# Altium schematic sheet Sheet1.SchDoc
size 635 x 635 mm; SheetNumber: 1; SheetTotal: 1
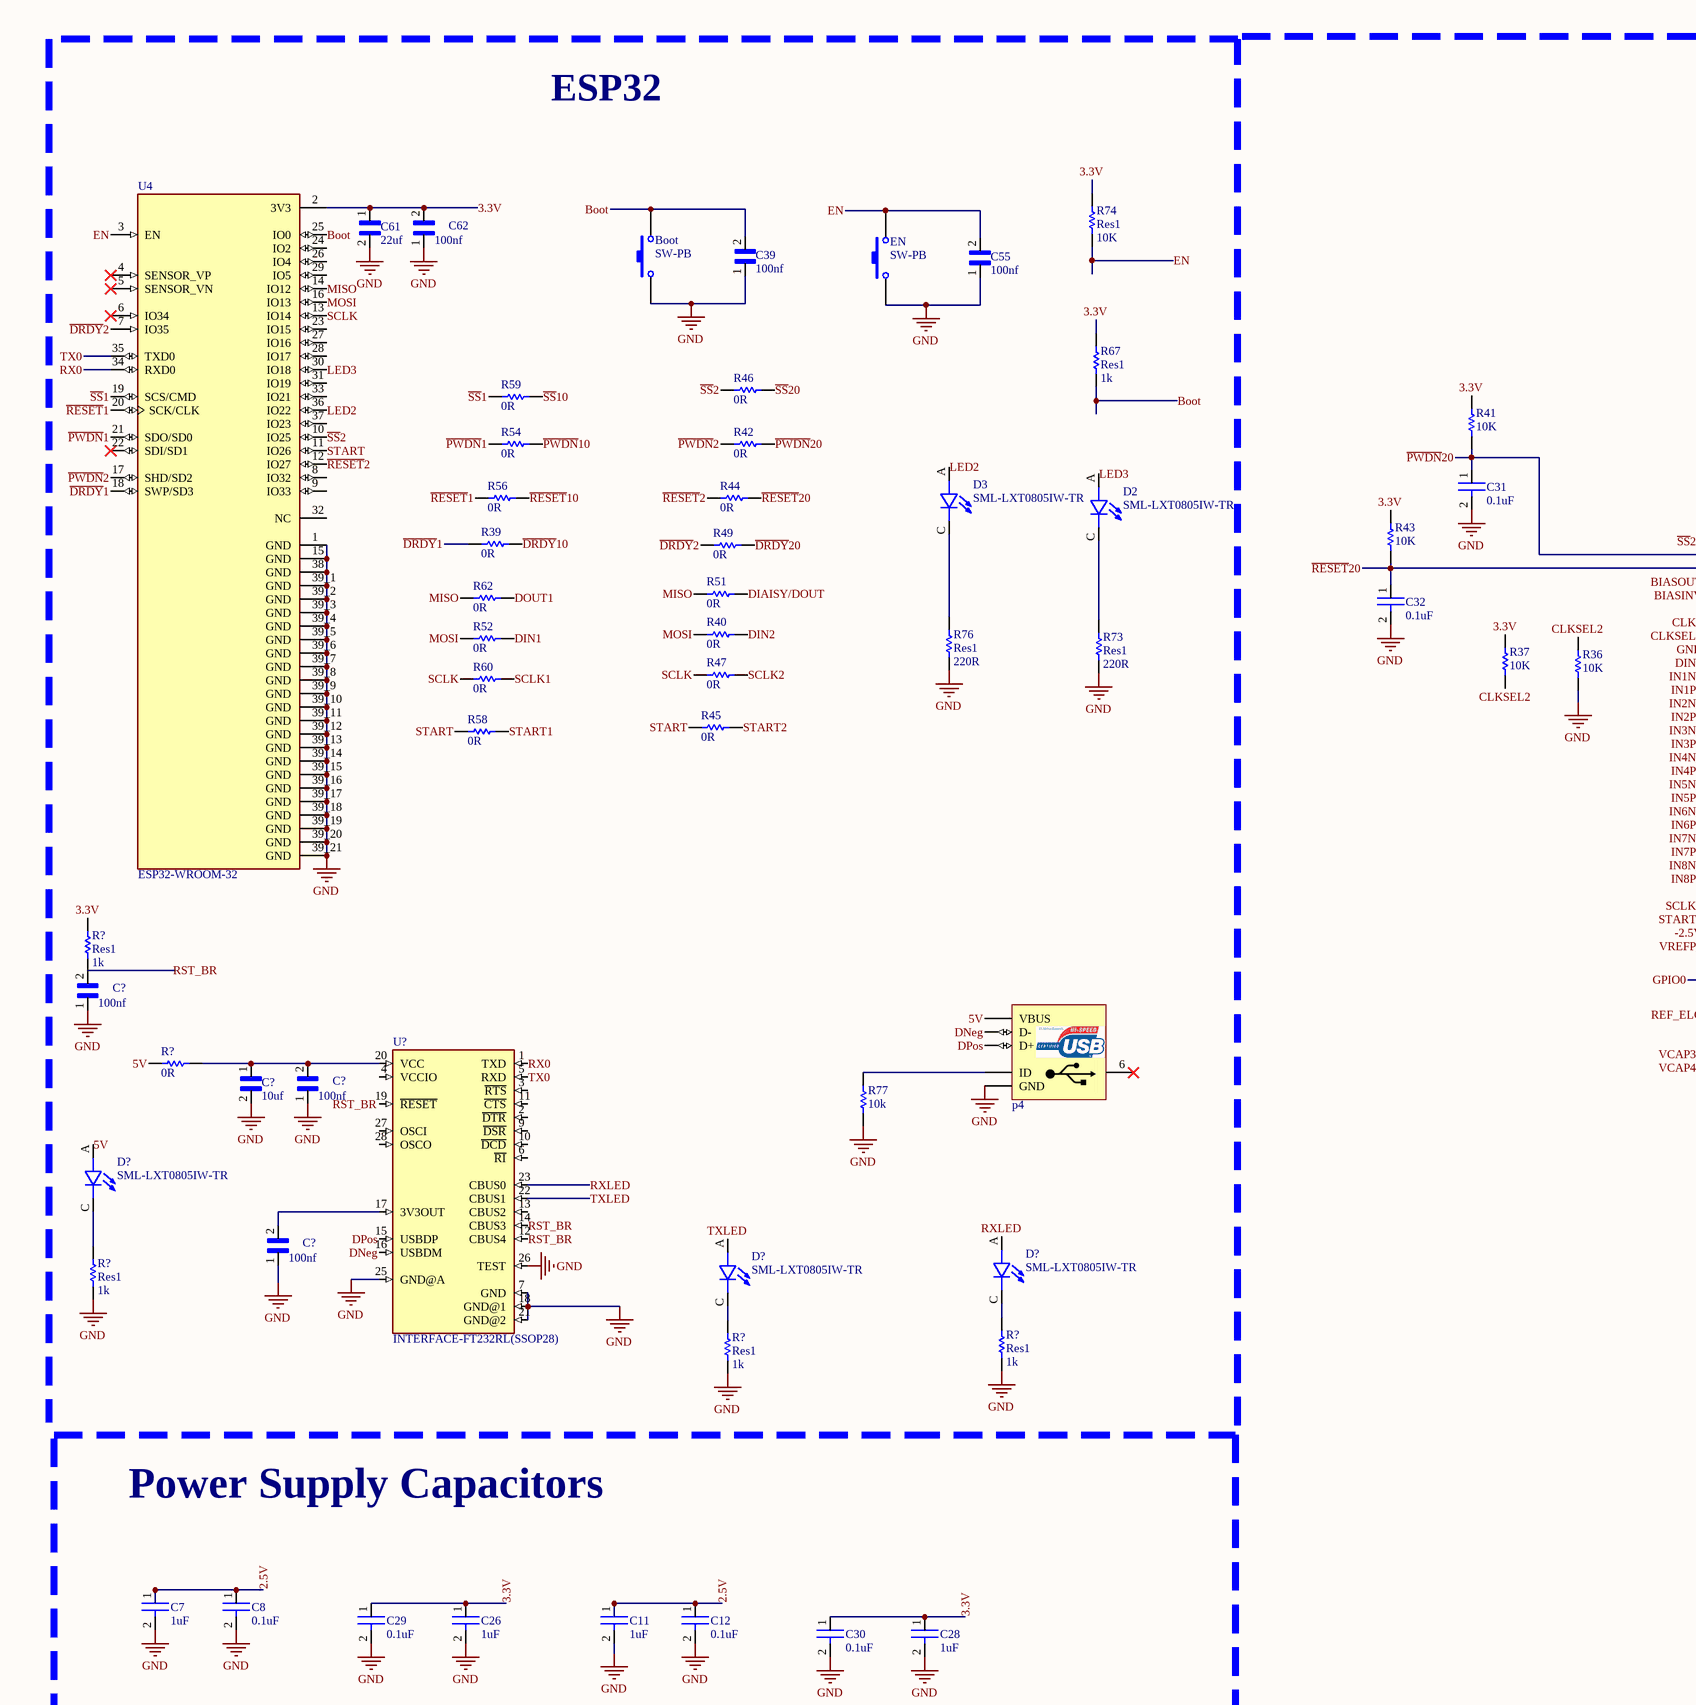
[diagram p0: Sheet1.SchDoc, top left]
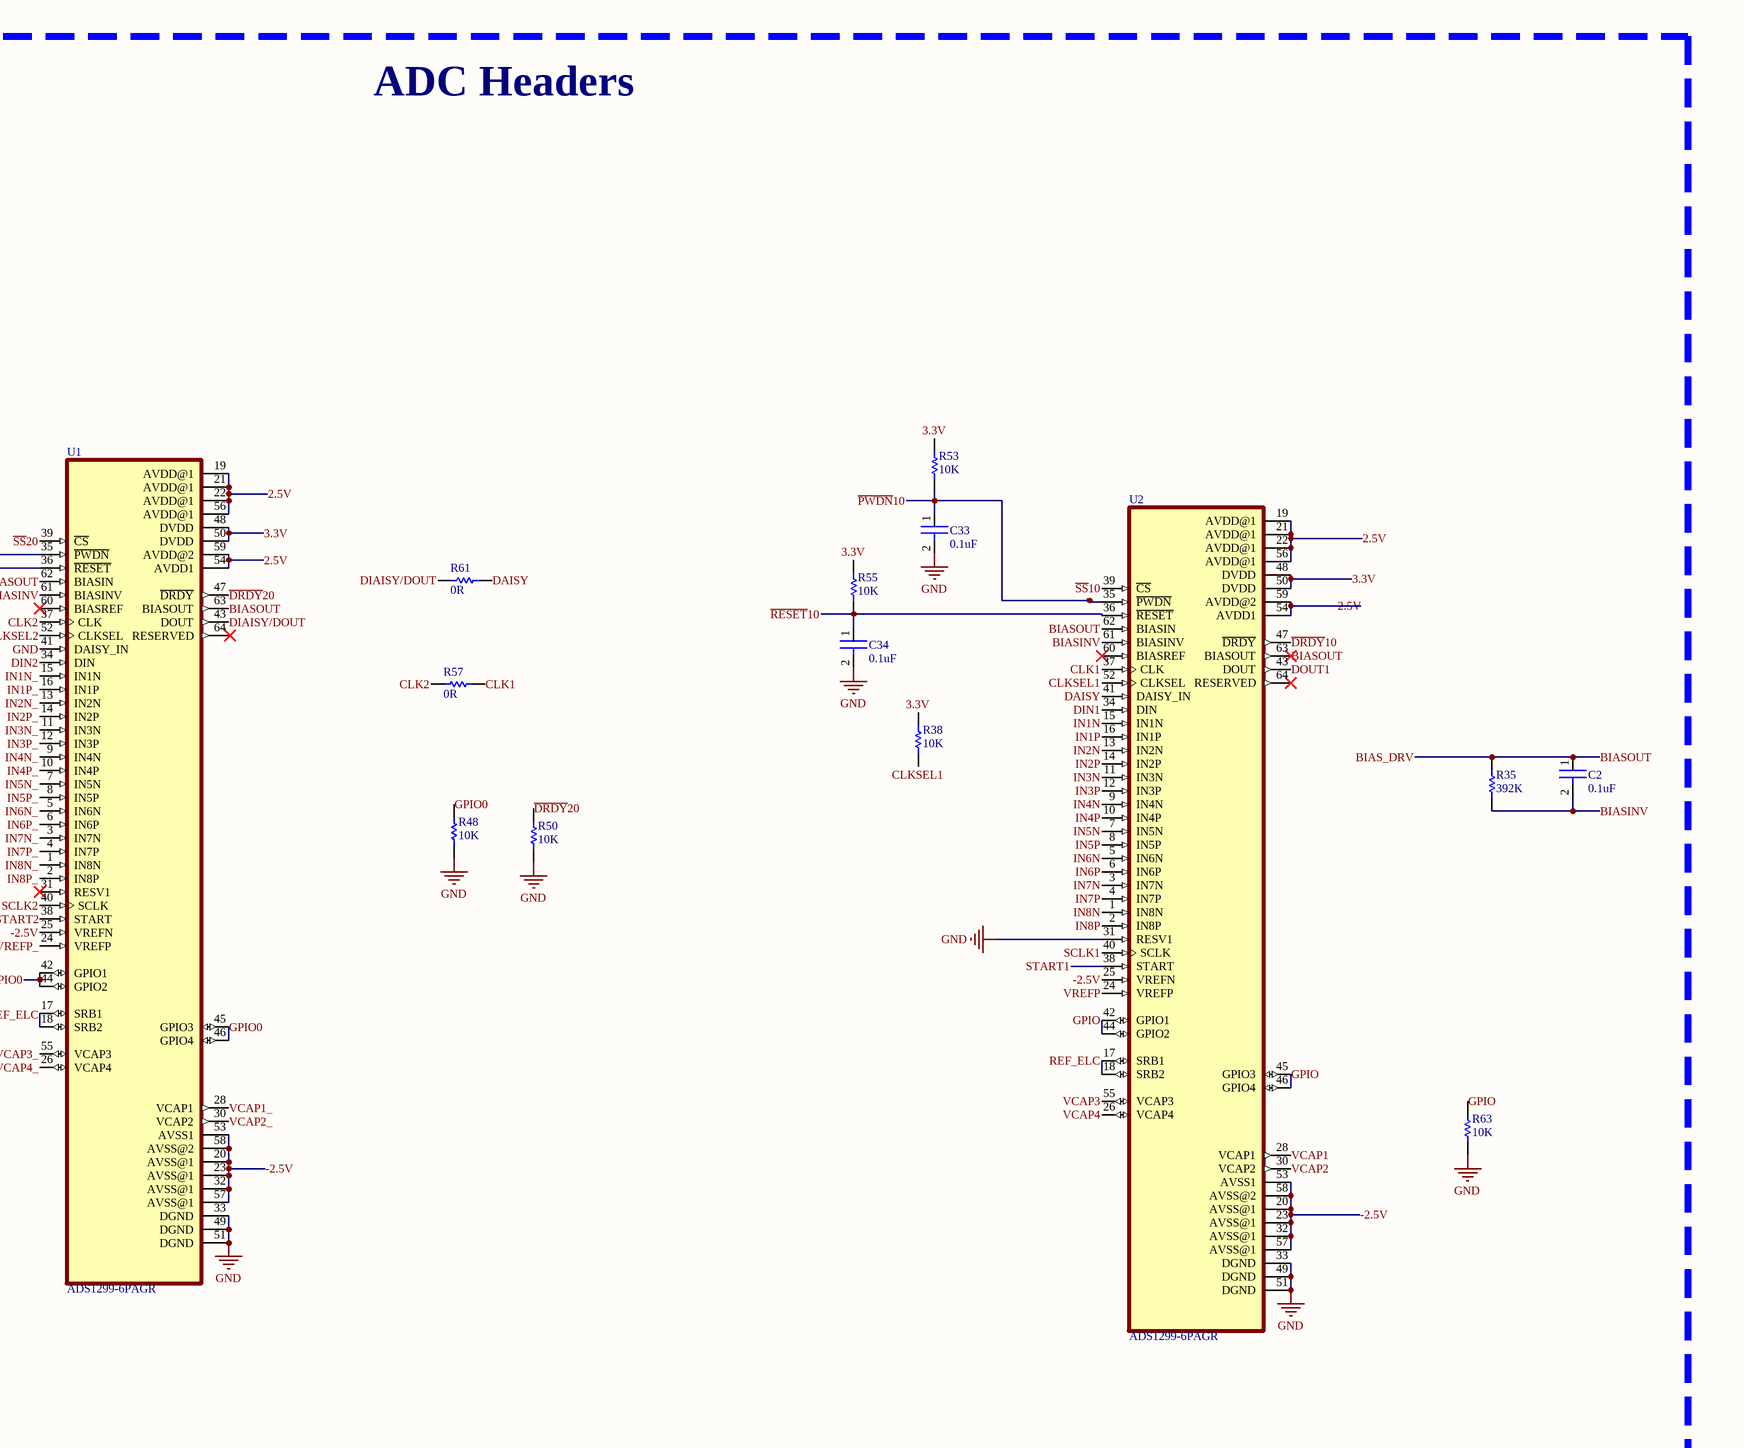
[diagram p1: Sheet1.SchDoc, top right]
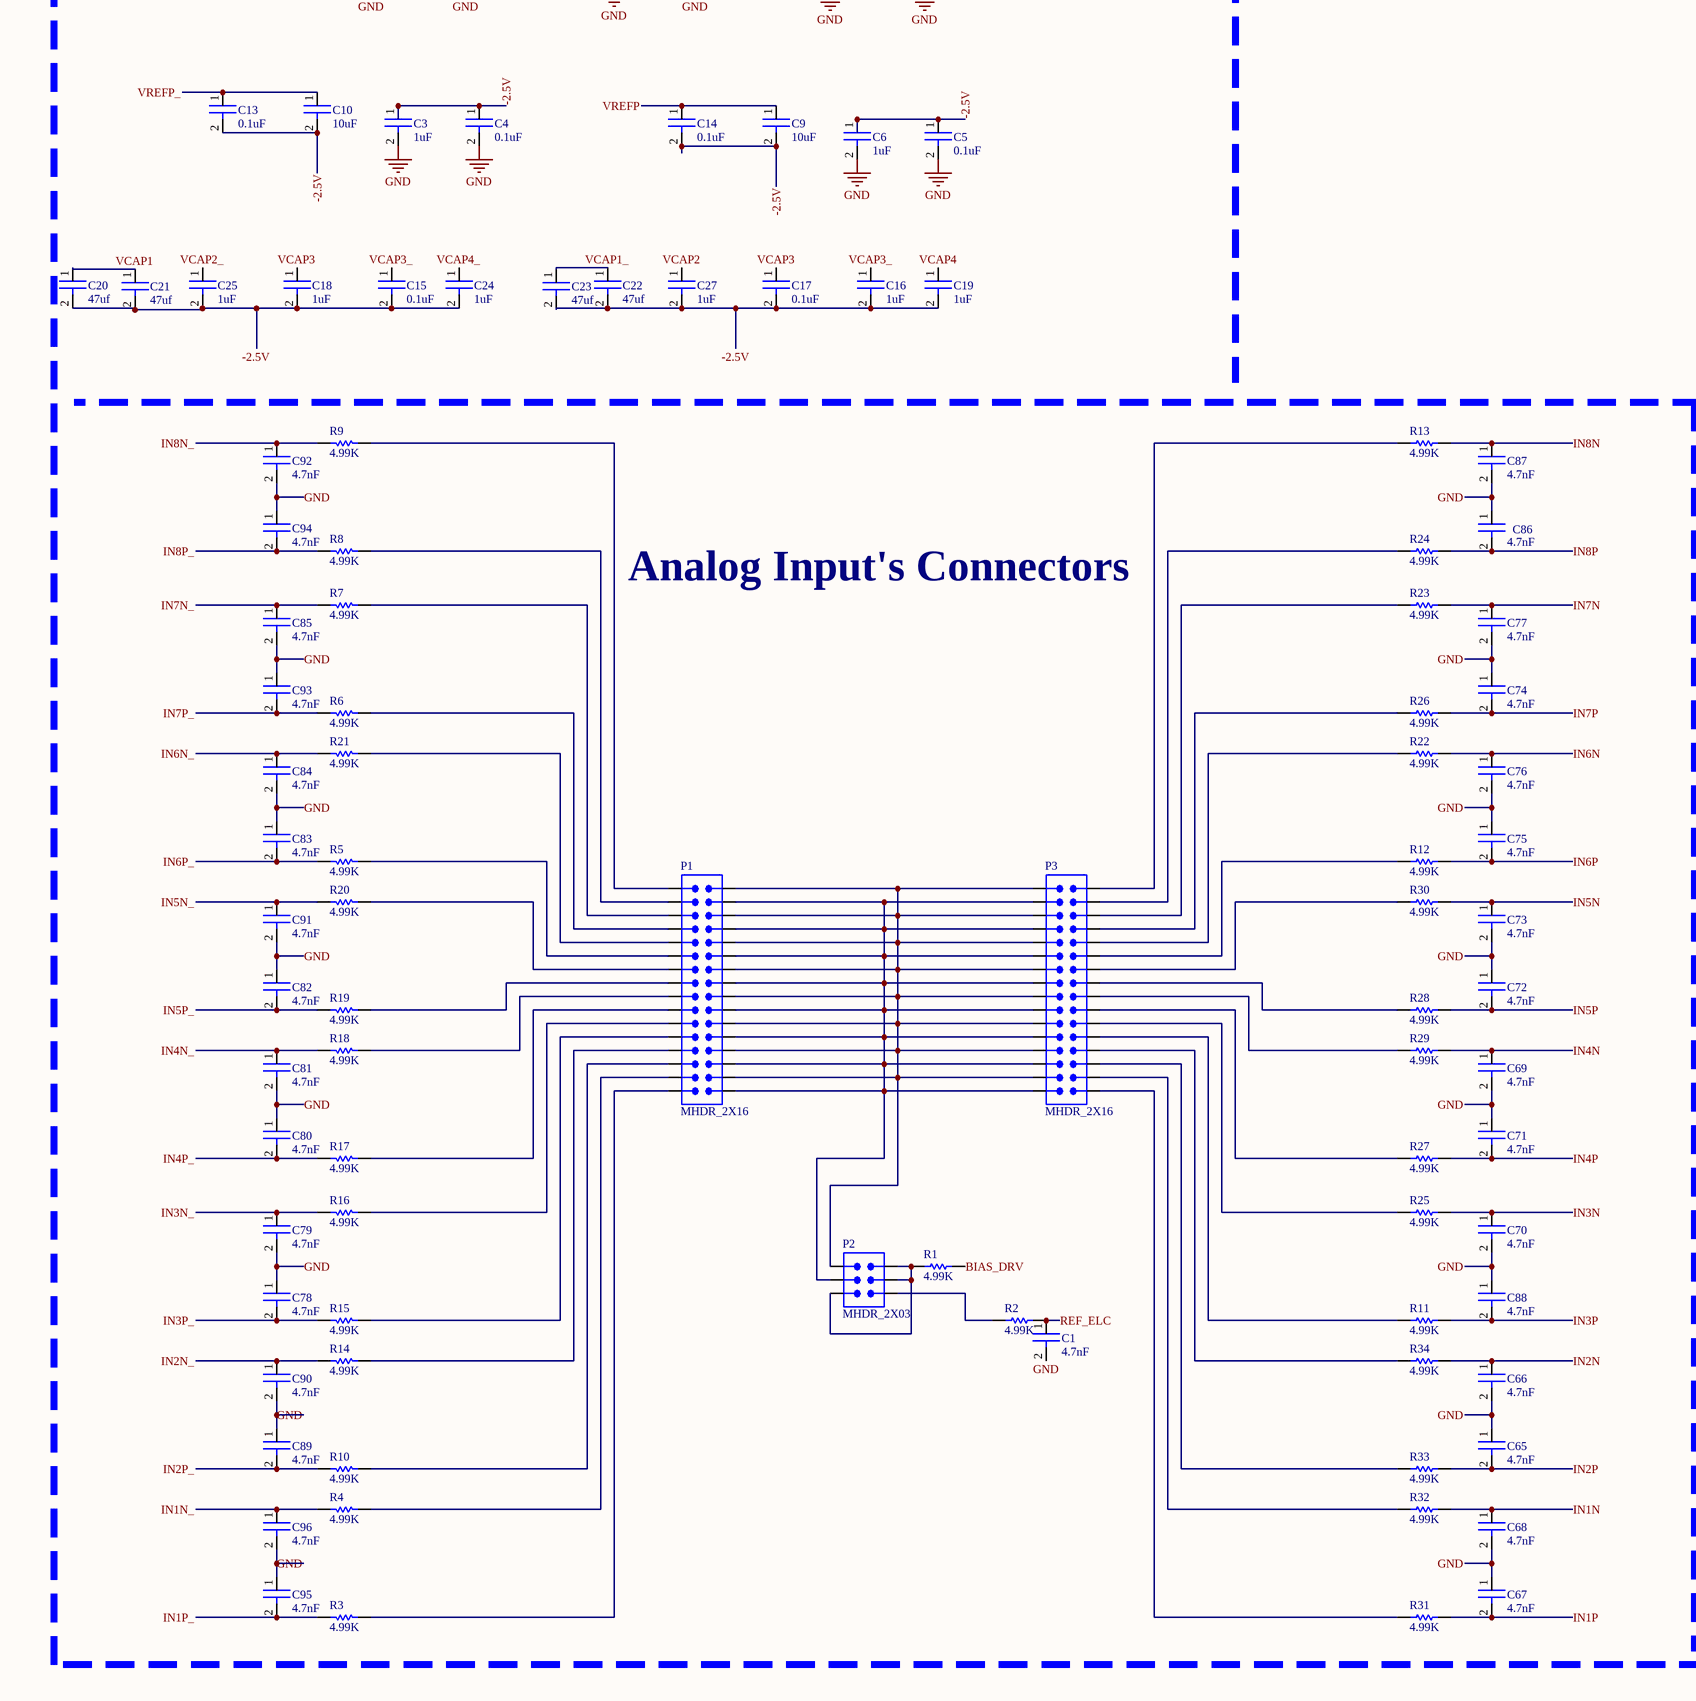
[diagram p2: Sheet1.SchDoc, bottom left]
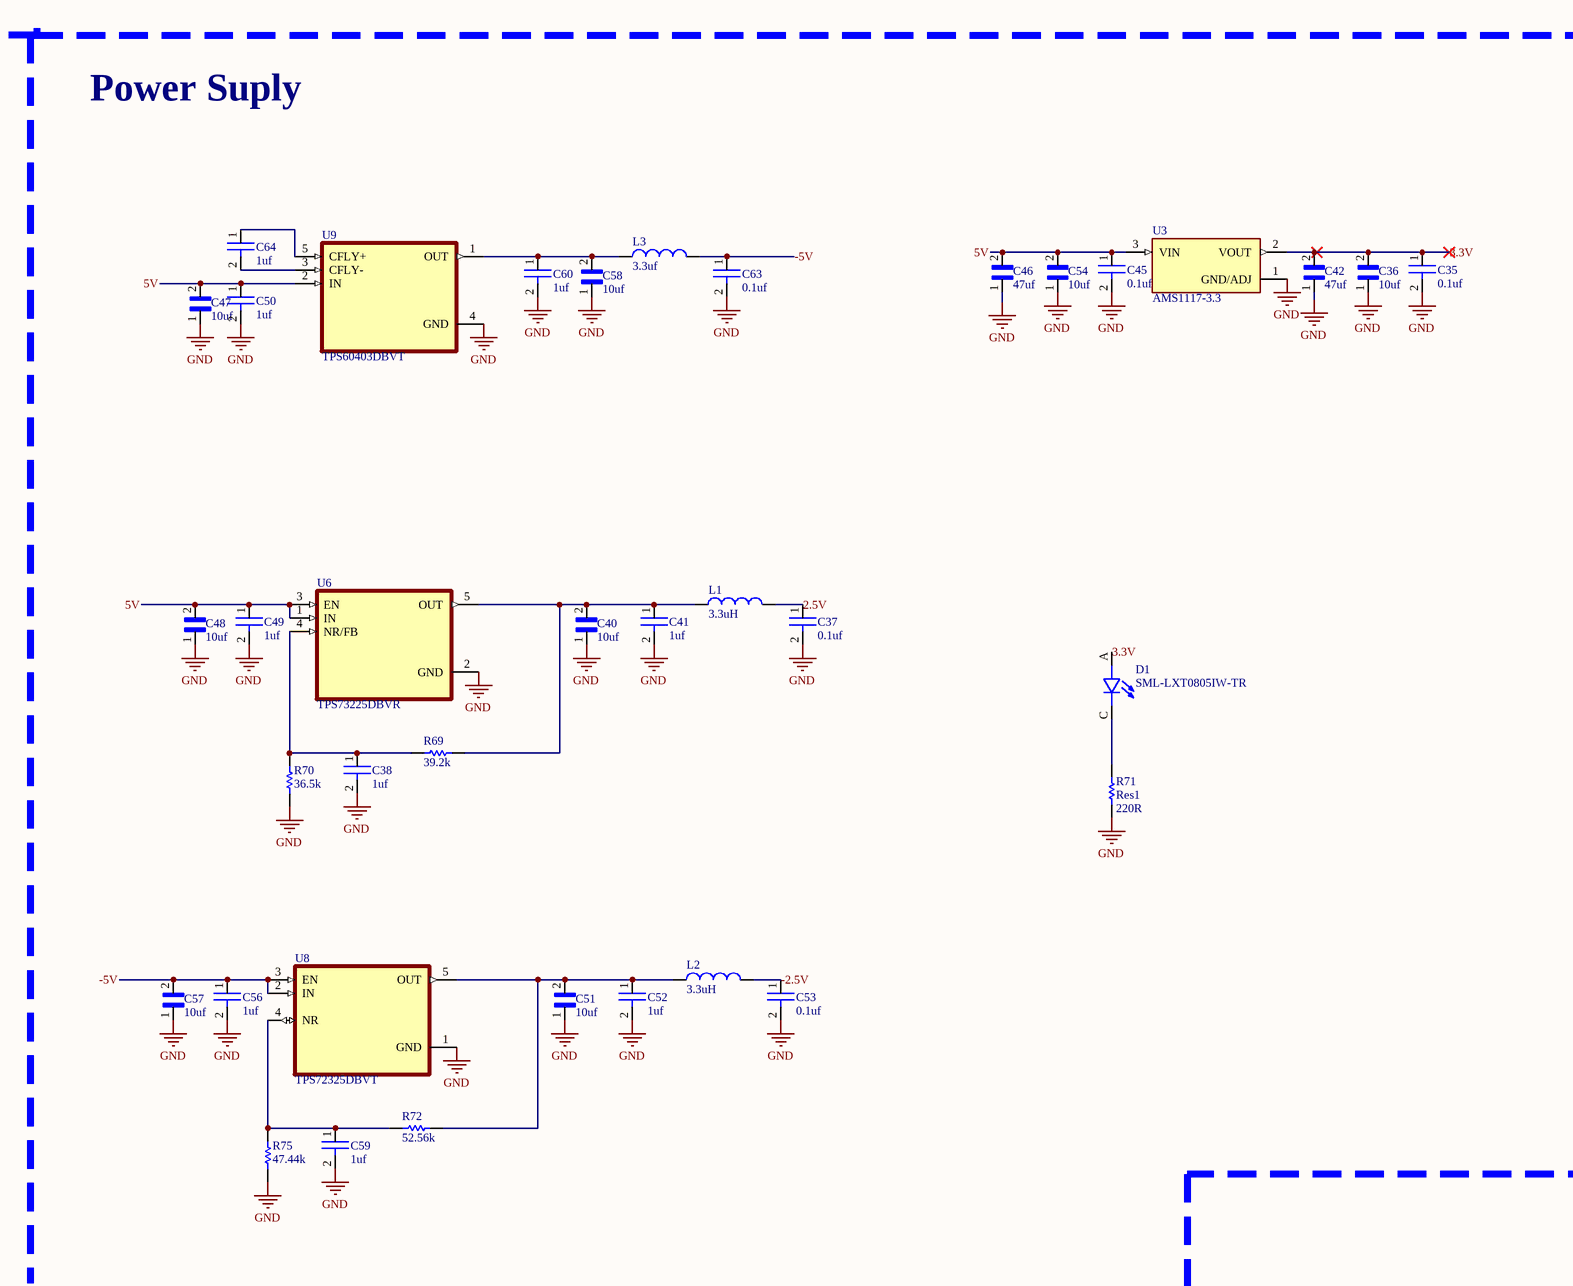
[diagram p3: Sheet1.SchDoc, bottom right]

## Parts
(Parts that share a designator on the sheet are numbered #1, #2 ... from top to bottom, then left to right.)
Boot  SW-PB  [SW-PB]
C1  4.7nF  [RESC1607X60N]
C2  0.1uF  [CAPC2012X135N]
C3  1uF  [CAPC2012X135N]
C4  0.1uF  [CAPC2012X135N]
C5  0.1uF  [CAPC2012X135N]
C6  1uF  [CAPC2012X135N]
C7  1uF  [CAPC2012X135N]
C8  0.1uF  [CAPC2012X135N]
C9  10uF  [CAPC3216X190N]
C10  10uF  [CAPC3216X190N]
C11  1uF  [CAPC2012X135N]
C12  0.1uF  [CAPC2012X135N]
C13  0.1uF  [CAPC2012X135N]
C14  0.1uF  [CAPC2012X135N]
C15  0.1uF  [CAPC2012X135N]
C16  1uF  [CAPC2012X135N]
C17  0.1uF  [CAPC2012X135N]
C18  1uF  [CAPC2012X135N]
C19  1uF  [CAPC2012X135N]
C20  47uf  [CAPC3216X190N]
C21  47uf  [CAPC3216X190N]
C22  47uf  [CAPC3216X190N]
C23  47uf  [CAPC3216X190N]
C24  1uF  [CAPC2012X135N]
C25  1uF  [CAPC2012X135N]
C26  1uF  [CAPC2012X135N]
C27  1uF  [CAPC2012X135N]
C28  1uF  [CAPC2012X135N]
C29  0.1uF  [CAPC2012X135N]
C30  0.1uF  [CAPC2012X135N]
C31  0.1uF  [CAPC2012X135N]
C32  0.1uF  [CAPC2012X135N]
C33  0.1uF  [CAPC2012X135N]
C34  0.1uF  [CAPC2012X135N]
C35  0.1uf  [CAPC2012X135N]
C36  10uf  [CAPC3216X190N]
C37  0.1uf  [CAPC2012X135N]
C38  1uf  [CAPC2012X135N]
C39  100nf  [CAPC2012X135N]
C40  10uf  [CAPC3216X190N]
C41  1uf  [CAPC2012X135N]
C42  47uf  [CAPC3216X190N]
C45  0.1uf  [CAPC2012X135N]
C46  47uf  [CAPC3216X190N]
C47  10uf  [CAPC3216X190N]
C48  10uf  [CAPC3216X190N]
C49  1uf  [CAPC2012X135N]
C50  1uf  [CAPC2012X135N]
C51  10uf  [CAPC3216X190N]
C52  1uf  [CAPC2012X135N]
C53  0.1uf  [CAPC2012X135N]
C54  10uf  [CAPC3216X190N]
C55  100nf  [CAPC2012X135N]
C56  1uf  [CAPC2012X135N]
C57  10uf  [CAPC3216X190N]
C58  10uf  [CAPC3216X190N]
C59  1uf  [CAPC2012X135N]
C60  1uf  [CAPC2012X135N]
C61  22uf  [CAPC3216X190N]
C62  100nf  [CAPC2012X135N]
C63  0.1uf  [CAPC2012X135N]
C64  1uf  [CAPC2012X135N]
C65  4.7nF  [RESC1607X60N]
C66  4.7nF  [RESC1607X60N]
C67  4.7nF  [RESC1607X60N]
C68  4.7nF  [RESC1607X60N]
C69  4.7nF  [RESC1607X60N]
C70  4.7nF  [RESC1607X60N]
C71  4.7nF  [RESC1607X60N]
C72  4.7nF  [RESC1607X60N]
C73  4.7nF  [RESC1607X60N]
C74  4.7nF  [RESC1607X60N]
C75  4.7nF  [RESC1607X60N]
C76  4.7nF  [RESC1607X60N]
C77  4.7nF  [RESC1607X60N]
C78  4.7nF  [RESC1607X60N]
C79  4.7nF  [RESC1607X60N]
C80  4.7nF  [RESC1607X60N]
C81  4.7nF  [RESC1607X60N]
C82  4.7nF  [RESC1607X60N]
C83  4.7nF  [RESC1607X60N]
C84  4.7nF  [RESC1607X60N]
C85  4.7nF  [RESC1607X60N]
C86  4.7nF  [RESC1607X60N]
C87  4.7nF  [RESC1607X60N]
C88  4.7nF  [RESC1607X60N]
C89  4.7nF  [RESC1607X60N]
C90  4.7nF  [RESC1607X60N]
C91  4.7nF  [RESC1607X60N]
C92  4.7nF  [RESC1607X60N]
C93  4.7nF  [RESC1607X60N]
C94  4.7nF  [RESC1607X60N]
C95  4.7nF  [RESC1607X60N]
C96  4.7nF  [RESC1607X60N]
C?#1  100nf  [CAPC2012X135N]
C?#2  10uf  [CAPC3216X190N]
C?#3  100nf  [CAPC2012X135N]
C?#4  100nf  [CAPC2012X135N]
D1  SML-LXT0805IW-TR  [LEDC2012X120N]
D2  SML-LXT0805IW-TR  [LEDC2012X120N]
D3  SML-LXT0805IW-TR  [LEDC2012X120N]
D?#1  SML-LXT0805IW-TR  [LEDC2012X120N]
D?#2  SML-LXT0805IW-TR  [LEDC2012X120N]
D?#3  SML-LXT0805IW-TR  [LEDC2012X120N]
EN  SW-PB  [SW-PB]
L1  3.3uH  [CAPC2012X135N]
L2  3.3uH  [CAPC2012X135N]
L3  3.3uf  [CAPC2012X135N]
P1  MHDR_2X16  [MHDR2X16-254P - E]
P2  MHDR_2X03  [MHDR2X03-254P - E]
P3  MHDR_2X16  [MHDR2X16-254P - E]
p4  USB Connector  [PCBComponent_1]  (value not drawn)
R1  4.99K  [RESC1607X60N]
R2  4.99K  [RESC1607X60N]
R3  4.99K  [RESC1607X60N]
R4  4.99K  [RESC1607X60N]
R5  4.99K  [RESC1607X60N]
R6  4.99K  [RESC1607X60N]
R7  4.99K  [RESC1607X60N]
R8  4.99K  [RESC1607X60N]
R9  4.99K  [RESC1607X60N]
R10  4.99K  [RESC1607X60N]
R11  4.99K  [RESC1607X60N]
R12  4.99K  [RESC1607X60N]
R13  4.99K  [RESC1607X60N]
R14  4.99K  [RESC1607X60N]
R15  4.99K  [RESC1607X60N]
R16  4.99K  [RESC1607X60N]
R17  4.99K  [RESC1607X60N]
R18  4.99K  [RESC1607X60N]
R19  4.99K  [RESC1607X60N]
R20  4.99K  [RESC1607X60N]
R21  4.99K  [RESC1607X60N]
R22  4.99K  [RESC1607X60N]
R23  4.99K  [RESC1607X60N]
R24  4.99K  [RESC1607X60N]
R25  4.99K  [RESC1607X60N]
R26  4.99K  [RESC1607X60N]
R27  4.99K  [RESC1607X60N]
R28  4.99K  [RESC1607X60N]
R29  4.99K  [RESC1607X60N]
R30  4.99K  [RESC1607X60N]
R31  4.99K  [RESC1607X60N]
R32  4.99K  [RESC1607X60N]
R33  4.99K  [RESC1607X60N]
R34  4.99K  [RESC1607X60N]
R35  392K  [CAPC2012X135N]
R36  10K  [CAPC2012X135N]
R37  10K  [CAPC2012X135N]
R38  10K  [CAPC2012X135N]
R39  0R  [CAPC2012X135N]
R40  0R  [CAPC2012X135N]
R41  10K  [CAPC2012X135N]
R42  0R  [CAPC2012X135N]
R43  10K  [CAPC2012X135N]
R44  0R  [CAPC2012X135N]
R45  0R  [CAPC2012X135N]
R46  0R  [CAPC2012X135N]
R47  0R  [CAPC2012X135N]
R48  10K  [CAPC2012X135N]
R49  0R  [CAPC2012X135N]
R50  10K  [CAPC2012X135N]
R51  0R  [CAPC2012X135N]
R52  0R  [CAPC2012X135N]
R53  10K  [CAPC2012X135N]
R54  0R  [CAPC2012X135N]
R55  10K  [CAPC2012X135N]
R56  0R  [CAPC2012X135N]
R57  0R  [CAPC2012X135N]
R58  0R  [CAPC2012X135N]
R59  0R  [CAPC2012X135N]
R60  0R  [CAPC2012X135N]
R61  0R  [CAPC2012X135N]
R62  0R  [CAPC2012X135N]
R63  10K  [CAPC2012X135N]
R67  Res1  value 1k  [CAPC2012X135N]
R69  39.2k  [CAPC2012X135N]
R70  36.5k  [CAPC2012X135N]
R71  Res1  value 220R  [CAPC2012X135N]
R72  52.56k  [CAPC2012X135N]
R73  Res1  value 220R  [CAPC2012X135N]
R74  Res1  value 10K  [CAPC2012X135N]
R75  47.44k  [CAPC2012X135N]
R76  Res1  value 220R  [CAPC2012X135N]
R77  10k  [CAPC2012X135N]
R?#1  Res1  value 1k  [CAPC2012X135N]
R?#2  0R  [CAPC2012X135N]
R?#3  Res1  value 1k  [CAPC2012X135N]
R?#4  Res1  value 1k  [CAPC2012X135N]
R?#5  Res1  value 1k  [CAPC2012X135N]
U1  ADS1299-6PAGR  [QFP50P1200X1200X120-64N]
U2  ADS1299-6PAGR  [QFP50P1200X1200X120-64N]
U3  AMS1117-3.3  [SOT229P700X180-4N]
U4  ESP32-WROOM-32  [MODULE_ESP32-WROOM-32]
U6  TPS73225DBVR  [SOT95P280X145-5N]
U8  TPS72325DBVT  [SOT95P280X145-5N]
U9  TPS60403DBVT  [SOT95P280X145-5N]
U?  INTERFACE-FT232RL(SSOP28)  [SSOP28-0.65-10.2X5.2MM]

## Nets
GND: Boot.1 C1.2(C) C3.2(C) C4.2(C) C5.2(C) C6.2(C) C7.2(C) C8.2(C) C11.2(C) C12.2(C) C26.2(C) C28.2(C) C29.2(C) C30.2(C) C31.2(C) C32.2(C) C33.2(C) C34.2(C) C35.2(C) C36.1 C37.2(C) C38.2(C) C39.1 C40.1 C41.2(C) C42.1 C45.2(C) C46.1 C47.1 C48.1 C49.2(C) C50.2(C) C51.1 C52.2(C) C53.2(C) C54.1 C55.1 C56.2(C) C57.1 C58.1 C59.2(C) C60.2(C) C61.2 C62.1 C63.2(C) C65.1(A) C66.2(C) C67.1(A) C68.2(C) C69.2(C) C70.2(C) C71.1(A) C72.1(A) C73.2(C) C74.1(A) C75.1(A) C76.2(C) C77.2(C) C78.1(A) C79.2(C) C80.1(A) C81.2(C) C82.1(A) C83.1(A) C84.2(C) C85.2(C) C86.1(A) C87.2(C) C88.1(A) C89.1(A) C90.2(C) C91.2(C) C92.2(C) C93.1(A) C94.1(A) C95.1(A) C96.2(C) C?#1.1 C?#2.2 C?#3.1 C?#4.1 EN.1 p4.G(GND) R36.1 R48.2 R50.2 R63.2 R70.2 R71.1 R73.1 R75.2 R76.1 R77.1 R?#3.1 R?#4.1 R?#5.1 U1.33(DGND) U1.41(DAISY_IN) U1.49(DGND) U1.51(DGND) U2.31(RESV1) U2.33(DGND) U2.49(DGND) U2.51(DGND) U3.1(GND/ADJ) U4.1(GND) U4.15(GND) U4.38(GND) U4.39_1(GND) U4.39_2(GND) U4.39_3(GND) U4.39_4(GND) U4.39_5(GND) U4.39_6(GND) U4.39_7(GND) U4.39_8(GND) U4.39_9(GND) U4.39_10(GND) U4.39_11(GND) U4.39_12(GND) U4.39_13(GND) U4.39_14(GND) U4.39_15(GND) U4.39_16(GND) U4.39_17(GND) U4.39_18(GND) U4.39_19(GND) U4.39_20(GND) U4.39_21(GND) U6.2(GND) U8.1(GND) U9.4(GND) U?.7(GND) U?.18(GND@1) U?.21(GND@2) U?.25(GND@A) U?.26(TEST)
2.5V: C7.1(A) C8.1(A) C11.1(A) C12.1(A) C37.1(A) L1.2 U1.19(AVDD@1) U1.21(AVDD@1) U1.22(AVDD@1) U1.54(AVDD1) U1.56(AVDD@1) U1.59(AVDD@2) U2.19(AVDD@1) U2.21(AVDD@1) U2.22(AVDD@1) U2.54(AVDD1) U2.56(AVDD@1) U2.59(AVDD@2)
3.3V: C26.1(A) C28.1(A) C29.1(A) C30.1(A) C35.1(A) C36.2 C42.2 C61.1 C62.2 D1.A R37.2 R38.2 R41.2 R43.2 R53.2 R55.2 R67.2 R74.2 R?#1.2 U1.48(DVDD) U1.50(DVDD) U2.48(DVDD) U2.50(DVDD) U3.2(VOUT) U4.2(3V3)
5V: C45.1(A) C46.2 C47.2 C48.2 C49.1(A) C50.1(A) C54.2 D?#1.A p4.VBUS R?#2.2 U3.3(VIN) U6.1(IN) U6.3(EN) U9.2(IN)
-2.5V: C3.1(A) C4.1(A) C5.1(A) C6.1(A) C9.2(C) C10.2(C) C13.2(C) C14.2(C) C15.2(C) C16.2(C) C17.2(C) C18.2(C) C19.2(C) C20.2(C) C21.2(C) C22.2(C) C23.2(C) C24.2(C) C25.2(C) C27.2(C) C53.1(A) L2.2 U1.20(AVSS@1) U1.23(AVSS@1) U1.25(VREFN) U1.32(AVSS@1) U1.53(AVSS1) U1.57(AVSS@1) U1.58(AVSS@2) U2.20(AVSS@1) U2.23(AVSS@1) U2.25(VREFN) U2.32(AVSS@1) U2.53(AVSS1) U2.57(AVSS@1) U2.58(AVSS@2)
-5V: C56.1(A) C57.2 C63.1(A) L3.2 U8.2(IN) U8.3(EN)
BIAS_DRV: C2.1(A) R1.1 R35.1 U1.62(BIASIN) U1.63(BIASOUT) U2.62(BIASIN) U2.63(BIASOUT)  [also labelled BIASOUT]
BIASINV: C2.2(C) R35.2 U1.61(BIASINV) U2.61(BIASINV)
Boot: Boot.2 C39.2 R67.1 U4.25(IO0)
CLK1: R57.1 U2.37(CLK)
CLK2: R57.2 U1.37(CLK)
CLKSEL1: R38.1 U2.52(CLKSEL)
CLKSEL2: R36.2 R37.1 U1.52(CLKSEL)
~{DRDY}1: R39.2 U4.18(SWP/SD3)
~{DRDY}2: R49.2 U4.7(IO35)
~{DRDY}10: R39.1 U2.47(~{DRDY})
~{DRDY}20: R49.1 R50.1 U1.47(~{DRDY})
DAISY: R61.1 U2.41(DAISY_IN)
DIAISY/DOUT: R51.1 R61.2 U1.43(DOUT)
DIN1: R52.1 U2.34(DIN)
DIN2: R40.1 U1.34(DIN)
DNeg: p4.D- U?.16(USBDM)
DOUT1: R62.1 U2.43(DOUT)
DPos: p4.D+ U?.15(USBDP)
EN: C55.2 EN.2 R74.1 U4.3(EN)
GPIO: R63.1 U2.42(GPIO1) U2.44(GPIO2) U2.45(GPIO3) U2.46(GPIO4)
GPIO0: R48.1 U1.42(GPIO1) U1.44(GPIO2) U1.45(GPIO3) U1.46(GPIO4)
IN1N: C68.1(A) R32.1 U2.15(IN1N)
IN1N_: C96.1(A) R4.1 U1.15(IN1N)
IN1P: C67.2(C) R31.1 U2.16(IN1P)
IN1P_: C95.2(C) R3.1 U1.16(IN1P)
IN2N: C66.1(A) R34.1 U2.13(IN2N)
IN2N_: C90.1(A) R14.1 U1.13(IN2N)
IN2P: C65.2(C) R33.1 U2.14(IN2P)
IN2P_: C89.2(C) R10.1 U1.14(IN2P)
IN3N: C70.1(A) R25.1 U2.11(IN3N)
IN3N_: C79.1(A) R16.1 U1.11(IN3N)
IN3P: C88.2(C) R11.1 U2.12(IN3P)
IN3P_: C78.2(C) R15.1 U1.12(IN3P)
IN4N: C69.1(A) R29.1 U2.9(IN4N)
IN4N_: C81.1(A) R18.1 U1.9(IN4N)
IN4P: C71.2(C) R27.1 U2.10(IN4P)
IN4P_: C80.2(C) R17.1 U1.10(IN4P)
IN5N: C73.1(A) R30.1 U2.7(IN5N)
IN5N_: C91.1(A) R20.1 U1.7(IN5N)
IN5P: C72.2(C) R28.1 U2.8(IN5P)
IN5P_: C82.2(C) R19.1 U1.8(IN5P)
IN6N: C76.1(A) R22.1 U2.5(IN6N)
IN6N_: C84.1(A) R21.1 U1.5(IN6N)
IN6P: C75.2(C) R12.1 U2.6(IN6P)
IN6P_: C83.2(C) R5.1 U1.6(IN6P)
IN7N: C77.1(A) R23.1 U2.3(IN7N)
IN7N_: C85.1(A) R7.1 U1.3(IN7N)
IN7P: C74.2(C) R26.1 U2.4(IN7P)
IN7P_: C93.2(C) R6.1 U1.4(IN7P)
IN8N: C87.1(A) R13.1 U2.1(IN8N)
IN8N_: C92.1(A) R9.1 U1.1(IN8N)
IN8P: C86.2(C) R24.1 U2.2(IN8P)
IN8P_: C94.2(C) R8.1 U1.2(IN8P)
LED2: D3.A U4.36(IO22)
LED3: D2.A U4.30(IO18)
MISO: R51.2 R62.2 U4.14(IO12)
MOSI: R40.2 R52.2 U4.16(IO13)
~{PWDN}1: R54.2 U4.21(SDO/SD0)
~{PWDN}2: R42.2 U4.17(SHD/SD2)
~{PWDN}10: C33.1(A) R53.1 R54.1 U2.35(~{PWDN})
~{PWDN}20: C31.1(A) R41.1 R42.1 U1.35(~{PWDN})
~{RESET}1: R56.2 U4.20(SCK/CLK)
~{RESET}2: R44.2 U4.12(IO27)
~{RESET}10: C34.1(A) R55.1 R56.1 U2.36(~{RESET})
~{RESET}20: C32.1(A) R43.1 R44.1 U1.36(~{RESET})
REF_ELC: C1.1(A) R2.1 U1.17(SRB1) U1.18(SRB2) U2.17(SRB1) U2.18(SRB2)
RST_BR: C?#1.2 U?.12(CBUS4) U?.14(CBUS3)
RX0: U4.34(RXD0) U?.1(TXD)
RXLED: D?#3.A U?.23(CBUS0)
~{SS}1: R59.2 U4.19(SCS/CMD)
~{SS}2: R46.2 U4.10(IO25)
~{SS}10: R59.1 U2.39(~{CS})
~{SS}20: R46.1 U1.39(~{CS})
SCLK: R47.2 R60.2 U4.13(IO14)
SCLK1: R60.1 U2.40(SCLK)
SCLK2: R47.1 U1.40(SCLK)
START: R45.2 R58.2 U4.11(IO26)
START1: R58.1 U2.38(START)
START2: R45.1 U1.38(START)
TX0: U4.35(TXD0) U?.5(RXD)
TXLED: D?#2.A U?.22(CBUS1)
VCAP1: C20.1(A) C21.1(A) U2.28(VCAP1)
VCAP1_: C22.1(A) C23.1(A) U1.28(VCAP1)
VCAP2: C27.1(A) U2.30(VCAP2)
VCAP2_: C25.1(A) U1.30(VCAP2)
VCAP3: C17.1(A) C18.1(A) U2.55(VCAP3)
VCAP3_: C15.1(A) C16.1(A) U1.55(VCAP3)
VCAP4: C19.1(A) U2.26(VCAP4)
VCAP4_: C24.1(A) U1.26(VCAP4)
VREFP: C9.1(A) C14.1(A) U2.24(VREFP)
VREFP_: C10.1(A) C13.1(A) U1.24(VREFP)
NetC38_1: C38.1(A) R69.1 R70.1 U6.4(NR/FB)
NetC40_2: C40.2 C41.1(A) L1.1 R69.2 U6.5(OUT)
NetC51_2: C51.2 C52.1(A) L2.1 R72.2 U8.5(OUT)
NetC58_2: C58.2 C60.1(A) L3.1 U9.1(OUT)
NetC59_1: C59.1(A) R72.1 R75.1 U8.4(NR)
NetC64_1: C64.1(A) U9.5(CFLY+)
NetC64_2: C64.2(C) U9.3(CFLY-)
NetC?#2_1: C?#2.1 C?#3.2 R?#2.1 U?.20(VCC)
NetC?#4_2: C?#4.2 U?.17(3V3OUT)
NetD1_C: D1.C R71.2
NetD2_C: D2.C R73.2
NetD3_C: D3.C R76.2
NetD?#1_C: D?#1.C R?#3.2
NetD?#2_C: D?#2.C R?#4.2
NetD?#3_C: D?#3.C R?#5.2
NetP1_1: P1.1 P1.5 P1.9 P1.13 P1.17 P1.21 P1.25 P1.29 P2.1 P3.1 P3.5 P3.9 P3.13 P3.17 P3.21 P3.25 P3.29
NetP1_2: P1.2 R9.2
NetP1_3: P1.3 P1.7 P1.11 P1.15 P1.19 P1.23 P1.27 P1.31 P2.3 P3.3 P3.7 P3.11 P3.15 P3.19 P3.23 P3.27 P3.31
NetP1_4: P1.4 R8.2
NetP1_6: P1.6 R7.2
NetP1_8: P1.8 R6.2
NetP1_10: P1.10 R21.2
NetP1_12: P1.12 R5.2
NetP1_14: P1.14 R20.2
NetP1_16: P1.16 R19.2
NetP1_18: P1.18 R18.2
NetP1_20: P1.20 R17.2
NetP1_22: P1.22 R16.2
NetP1_24: P1.24 R15.2
NetP1_26: P1.26 R14.2
NetP1_28: P1.28 R10.2
NetP1_30: P1.30 R4.2
NetP1_32: P1.32 R3.2
NetP2_2: P2.2 P2.4 P2.5 R1.2
NetP2_6: P2.6 R2.2
NetP3_2: P3.2 R13.2
NetP3_4: P3.4 R24.2
NetP3_6: P3.6 R23.2
NetP3_8: P3.8 R26.2
NetP3_10: P3.10 R22.2
NetP3_12: P3.12 R12.2
NetP3_14: P3.14 R30.2
NetP3_16: P3.16 R28.2
NetP3_18: P3.18 R29.2
NetP3_20: P3.20 R27.2
NetP3_22: P3.22 R25.2
NetP3_24: P3.24 R11.2
NetP3_26: P3.26 R34.2
NetP3_28: P3.28 R33.2
NetP3_30: P3.30 R32.2
NetP3_32: P3.32 R31.2
Netp4_ID: p4.ID R77.2

Not connected (* = marked no-connect by the designer): p4 6(MH)*; R?#1 1; U1 31(RESV1)* 60(BIASREF)* 64(RESERVED); U2 60(BIASREF)* 64(RESERVED)*; U4 4(SENSOR_VP)* 5(SENSOR_VN)* 6(IO34)* 8(IO32) 9(IO33) 22(SDI/SD1)* 23(IO15) 24(IO2) 26(IO4) 27(IO16) 28(IO17) 29(IO5) 31(IO19) 32(NC) 33(IO21) 37(IO23); U? 2(~{DTR}) 3(~{RTS}) 4(VCCIO) 6(~{RI}) 9(~{DSR}) 10(~{DCD}) 11(~{CTS}) 13(CBUS2) 19(~{RESET}) 27(OSCI) 28(OSCO)

## Notes on the sheet
- ESP32
- ADC Headers
- Power Supply Capacitors
- Power Suply
- Analog Input's Connectors
- Labels drawn without touching a wire or pin: RST_BR
- (in symbol USB AB MICRO CONNECTOR) D:AbbasBasereh

## Library data of the parts
Boot EN = SW-PB: Switch; Published: 24-Mar-1999; LatestRevisionDate: 17-Jul-2002; LatestRevisionNote: Re-released for DXP Platform.; PackageReference: SPST-2; Publisher: Altium Limited; PackageDescription: Switch; 2 Leads
C1-C35 C37 C38 C41 C45 C49 C50 C52 C53 C56 C59 C60 C63-C96 = GRM21BR71C105KA01K: SMD Capacitor X7R(EIA) with Capacitance: 1.0uF Tol. 10%. Rated Voltage: 16Vdc; MF: Murata; SnapEDA_Link: https://www.snapeda.com/parts/GRM21BR71C105KA01K/Murata%20Electronics%20North%20America/view-part/1149186/?ref=snap; Mouser-Purchase-URL: https://snapeda.com/shop?store=Mouser&id=1149186; Digi-Key_Part_Number: 490-11597-1-ND; DigiKey-Purchase-URL: https://snapeda.com/shop?store=DigiKey&id=1149186; Value: *; MP: GRM21BR71C105KA01K; Package: 0805 Murata; BuyPart: https://www.snapeda.com/parts/GRM21BR71C105KA01K/Murata%20Electronics%20North%20America/view-part/1149186/?ref=eda
C36 C40 C42 C46-C48 C51 C54 C57 C58 = GRM31CD71H106KE11K: SMD Capacitor X7T(EIA) with Capacitance: 10uF Tol. 10%. Rated Voltage: 50Vdc; Package: None; Price: None; Value: *; MP: GRM31CD71H106KE11K; Availability: Unavailable
C39 C55 C62 C?#1 C?#3 C?#4 = VJ0805D390MXCAP: Package: None; Price: None; Value: *; MP: VJ0805D390MXCAP; Availability: Unavailable
C61 C?#2 = C1206C106K3RACTU: 10ÂµF Â±10% 25V Ceramic Capacitor X7R 1206 _3216 Metric_; MF: KEMET; Value: *; SnapEDA_Link: https://www.snapeda.com/parts/C1206C106K3RACTU/KEMET/view-part/1755641/?ref=snap; Package: 1206 KEMET; MP: C1206C106K3RACTU; Digi-Key_Purchase_URL: https://www.digikey.com/product-detail/en/kemet/C1206C106K3RACTU/399-7442-1-ND/3317476?utm_source=snapeda&utm_medium=aggregator&utm_campaign=symbol; Digi-Key_Part_Number: 399-7442-1-ND
D1-D3 D?#1-D?#3 = SML-LXT0805IW-TR: LED;Red;11mcd;0.061In.Dia.;SMD;100mA;2V Vf;635nm;140deg;SMD;White Diffused;5V Vr | Lumex SML-LXT0805IW-TR; MF: Lumex Opto/Components; SnapEDA_Link: https://www.snapeda.com/parts/SML-LXT0805IW-TR/Lumex+Opto%252FComponents+Inc./view-part/?ref=snap; Package: 0805 Lumex; Value: *; MP: SML-LXT0805IW-TR; Check_prices: https://www.snapeda.com/parts/SML-LXT0805IW-TR/Lumex+Opto%252FComponents+Inc./view-part/?ref=eda
L1-L3 = INDUCTOR SMD
P1 P3 = MHDR_2X16: Male Header 2X16
P2 = MHDR_2X03: Male Header 2X03
p4 = USB AB MICRO CONNECTOR: USB MICRO-B Type Connector; Designer: ABBAS BASEREH; Max Current: 1600mA; Mounting Technology: Surface Mount\Through-Hole; Category: Connector; Pin Count: 5-7; Publisher: ABBAS BASEREH; Status: Unreleased; ComponentLink1Description: Datasheet; ComponentLink2Description: Reference; Update: 1395-11-17
R1-R38 R41 R43 R48 R50 R53 R55 R63 = 10K: 1.8W
R39 R40 R42 R44-R47 R49 R51 R52 R54 R56-R62 R69 R70 R72 R75 R77 R?#2 = RES 0805 0.125W: RES 0805; Designer: Abbas Basereh; Desc.: RES SMD 0805; Data: 16-12-2016
R67 R71 R73 R74 R76 R?#1 R?#3-R?#5 = Res1: Resistor; Published: 8-Jun-2000; LatestRevisionDate: 17-Jul-2002; LatestRevisionNote: Re-released for DXP Platform.; PackageReference: AXIAL-0.3; Publisher: Altium Limited; PackageDescription: Axial Device, Thru-Hole; 2 Leads; 0.3 in Pin Spacing
U1 U2 = ADS1299-6PAGR: Low-Noise, 6-Channel, 24-Bit Analog-to-Digital Converter for Biopotential Measurements 64-TQFP -40 to 85; MF: Texas Instruments; Price: None; Availability: Warning; MP: ADS1299-6PAGR; Package: TQFP-64 Texas Instruments; SnapEDA_Link: https://www.snapeda.com/parts/ADS1299-6PAGR/Texas%20Instruments/view-part/1219452/?ref=snap; Check_prices: https://www.snapeda.com/parts/ADS1299-6PAGR/Texas%20Instruments/view-part/1219452/?ref=eda; Value: *; Purchase-URL: https://pricing.snapeda.com/search/part/ADS1299-6PAGR/?ref=eda
U3 = AMS1117-3.3: Sot223/Pkg 1-Amp 3.3-Volt Low Drop Out Voltage Regulatator; MF: Advanced Monolithic Systems; Package: SOT-223 Seeed Technology; Value: *; Check_prices: https://www.snapeda.com/parts/AMS1117-3.3/Advanced+Monolithic+Systems/view-part/?ref=eda; Price: None; Availability: Not in stock; MP: AMS1117-3.3; SnapEDA_Link: https://www.snapeda.com/parts/AMS1117-3.3/Advanced+Monolithic+Systems/view-part/?ref=snap
U4 = ESP32-WROOM-32: Bluetooth, WiFi 802.11b/g/n, Bluetooth v4.2 +EDR, Class 1, 2 and 3 Transceiver Module 2.4GHz ~ 2.5GHz Antenna Not Included, U.FL Surface Mount; MF: Espressif Systems; Price: None; Availability: In Stock; MP: ESP32-WROOM-32; Package: Module Espressif Systems; SnapEDA_Link: https://www.snapeda.com/parts/ESP32-WROOM-32/Espressif+Systems/view-part/?ref=snap; Check_prices: https://www.snapeda.com/parts/ESP32-WROOM-32/Espressif+Systems/view-part/?ref=eda; Value: *; Purchase-URL: https://pricing.snapeda.com/search/part/ESP32-WROOM-32/?ref=eda
U6 = TPS73225DBVR: 250-mA, high-accuracy, ultra-low-dropout voltage regulator with reverse current protection & enable 5-SOT-23 -40 to 125; MF: Texas Instruments; Package: SOT-23-5 Texas Instruments; Availability: Unavailable; Value: *; MP: TPS73225DBVR; SnapEDA_Link: https://www.snapeda.com/parts/TPS73225DBVR/Texas%20Instruments/view-part/1237159/?ref=snap; Price: None; Purchase-URL: https://pricing.snapeda.com/search/part/TPS73225DBVR/?ref=eda; Check_prices: https://www.snapeda.com/parts/TPS73225DBVR/Texas%20Instruments/view-part/1237159/?ref=eda
U8 = TPS72325DBVT: 200mA, Negative Output Low-Dropout Linear Regulator; MF: Texas Instruments; Package: SOT-23-5 Texas Instruments; MP: TPS72325DBVT; DigiKey-Purchase-URL: https://snapeda.com/shop?store=DigiKey&id=46470; Price: None; Texas_Instruments-Purchase-URL: https://snapeda.com/shop?store=Texas+Instruments&id=46470; Availability: Unavailable; Value: *; Mouser-Purchase-URL: https://snapeda.com/shop?store=Mouser&id=46470; SnapEDA_Link: https://www.snapeda.com/parts/TPS72325DBVT/Texas%20Instruments/view-part/46470/?ref=snap
U9 = TPS60403DBVT: 60mA Charge Pump Voltage Inverter with Fixed 250kHz Operation 5-SOT-23 -40 to 85; MF: Texas Instruments; Purchase-URL: https://pricing.snapeda.com/search/part/TPS60403DBVT/?ref=eda; SnapEDA_Link: https://www.snapeda.com/parts/TPS60403DBVT/Texas%20Instruments/view-part/229700/?ref=snap; MP: TPS60403DBVT; Package: SOT-23-5 Texas Instruments; Price: None; Availability: Good; Value: *; Check_prices: https://www.snapeda.com/parts/TPS60403DBVT/Texas%20Instruments/view-part/229700/?ref=eda
U? = INTERFACE-FT232RL(SSOP28): USB-Ð¼Ð¾ÑÑ‚, Ð¸Ð½Ñ‚ÐµÑ€Ñ„ÐµÐ¹Ñ USB Ðº UART USB 2.0 UART 28-SSOP; MF: FTDI, Future; SnapEDA_Link: https://www.snapeda.com/parts/FT232RL/FTDI%252C+Future+Technology+Devices+International+Ltd/view-part/?ref=snap; Availability: Not in stock; MP: FT232RL; Price: None; Value: *; Check_prices: https://www.snapeda.com/parts/FT232RL/FTDI%252C+Future+Technology+Devices+International+Ltd/view-part/?ref=eda; Package: SSOP-28 FTDI